# Altium project Austindetz_CM4_Board_v1.0.PrjPcb (part 1 of 2)
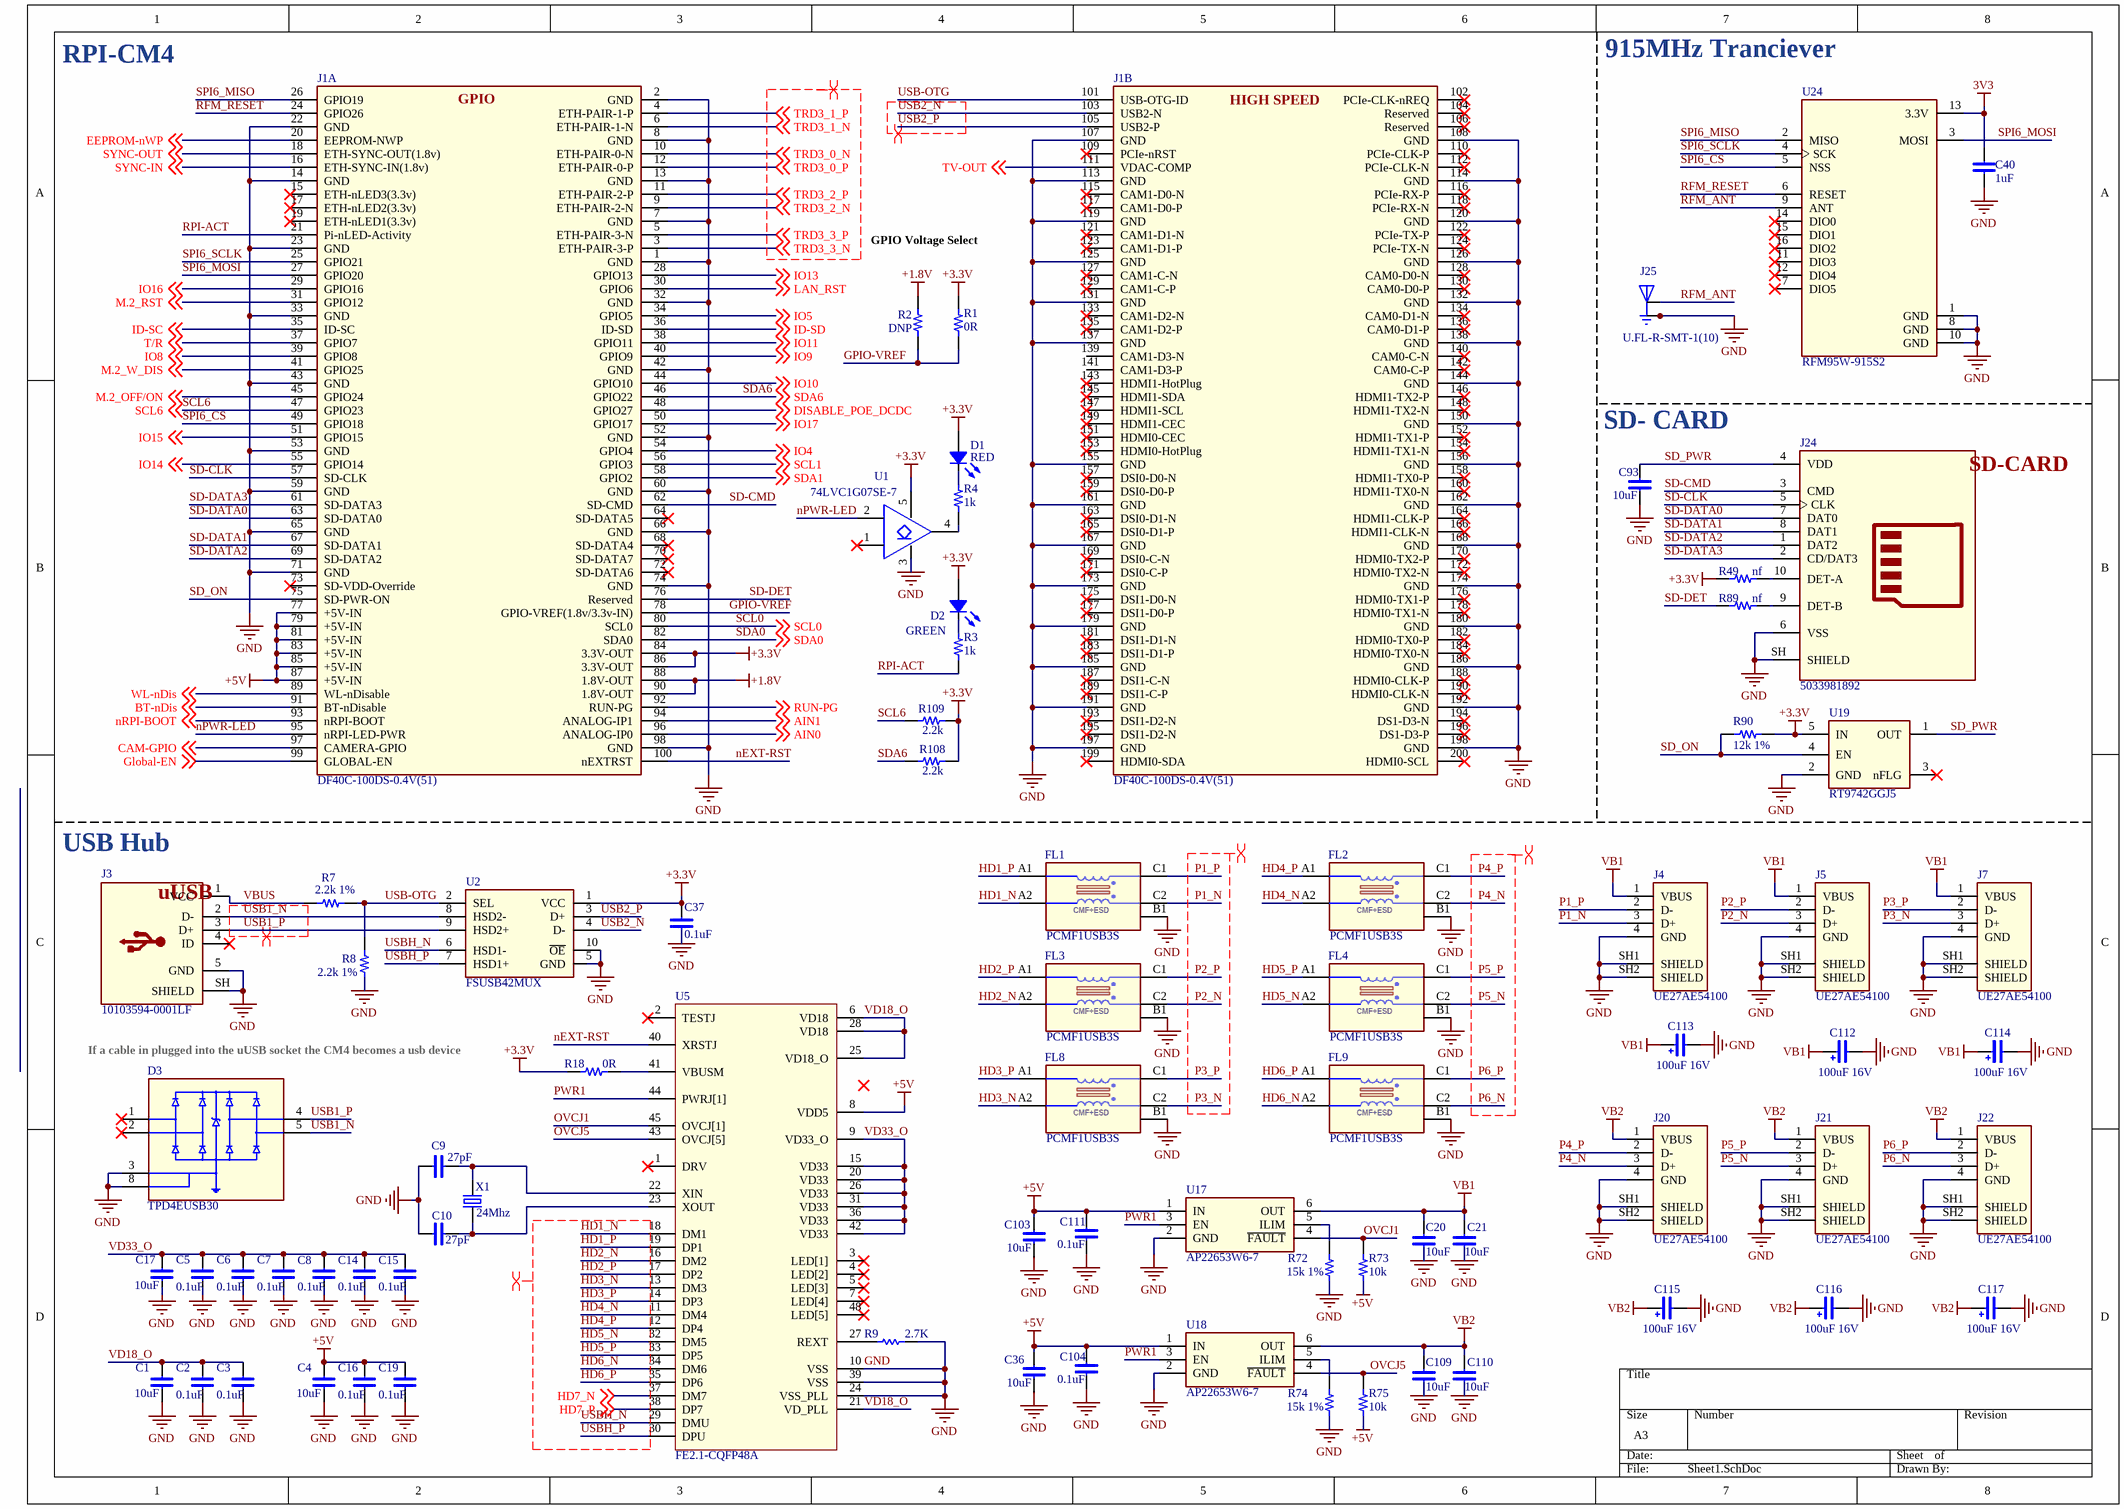
[diagram p0: Sheet1.SchDoc]
5 sheets, 407 parts. Net scope: global (net labels, ports and power ports of the same name join across sheets).
Board file: Austindetz_CM4_Board_v1.0.PcbDoc
Sheets:
  Sheet1.SchDoc
  Sheet2.SchDoc
  Sheet3.SchDoc
  Sheet4.SchDoc
  Sheet5.SchDoc

## Sheet Sheet1.SchDoc
size A3; DocumentNumber: 1; SheetNumber: 1; SheetTotal: 2

### Parts
C1  10uF  [C-0603/1608]
C2  0.1uF  [C-0402/1005]
C3  0.1uF  [C-0402/1005]
C4  10uF  [C-0603/1608]
C5  0.1uF  [C-0402/1005]
C6  0.1uF  [C-0402/1005]
C7  0.1uF  [C-0402/1005]
C8  0.1uF  [C-0402/1005]
C9  27pF  [C-0402/1005]
C10  27pF  [C-0402/1005]
C14  0.1uF  [C-0402/1005]
C15  0.1uF  [C-0402/1005]
C16  0.1uF  [C-0402/1005]
C17  10uF  [C-0603/1608]
C19  0.1uF  [C-0402/1005]
C20  10uF  [C-0603/1608]
C21  10uF  [C-0603/1608]
C36  10uF  [C-0603/1608]
C37  0.1uF  [C-0402/1005]
C40  1uF  [C-0402/1005]
C93  10uF  [C-0805/2012]
C103  10uF  [C-0603/1608]
C104  0.1uF  [C-0402/1005]
C109  10uF  [C-0603/1608]
C110  10uF  [C-0603/1608]
C111  0.1uF  [C-0402/1005]
C112  100uF 16V  [CAP-TAN-2312]
C113  100uF 16V  [CAP-TAN-2312]
C114  100uF 16V  [CAP-TAN-2312]
C115  100uF 16V  [CAP-TAN-2312]
C116  100uF 16V  [CAP-TAN-2312]
C117  100uF 16V  [CAP-TAN-2312]
D1  RED  [LED-0603-RED]
D2  GREEN  [LED-0603-Green]
D3  TPD4EUSB30  [10-USON (2.5x1)]
FL1  PCMF1USB3S  [WLCSP5(2-1-2)_NEX]
FL2  PCMF1USB3S  [WLCSP5(2-1-2)_NEX]
FL3  PCMF1USB3S  [WLCSP5(2-1-2)_NEX]
FL4  PCMF1USB3S  [WLCSP5(2-1-2)_NEX]
FL8  PCMF1USB3S  [WLCSP5(2-1-2)_NEX]
FL9  PCMF1USB3S  [WLCSP5(2-1-2)_NEX]
J1  DF40C-100DS-0.4V(51)  [RPI-CM4]  (parts A,B of 2)
J3  10103594-0001LF  [USB-micro]
J4  UE27AE54100  [AMPHENOL_UE27AE54100]
J5  UE27AE54100  [AMPHENOL_UE27AE54100]
J7  UE27AE54100  [AMPHENOL_UE27AE54100]
J20  UE27AE54100  [AMPHENOL_UE27AE54100]
J21  UE27AE54100  [AMPHENOL_UE27AE54100]
J22  UE27AE54100  [AMPHENOL_UE27AE54100]
J24  5033981892  [MOLEX-503398-1892]
J25  U.FL-R-SMT-1(10)  [HRS_U.FL-R-SMT-1(10)]
R1  0R  [R-0603/1608]
R2  DNP  [R-0603/1608]
R3  1k  [R-0402/1005]
R4  1k  [R-0402/1005]
R7  2.2k 1%  [R-0402/1005]
R8  2.2k 1%  [R-0402/1005]
R9  value 2.7K  [R-0402/1005]
R18  0R  [R-0402/1005]
R49  nf  [R-0402/1005]
R72  15k 1%  [R-0402/1005]
R73  10k  [R-0402/1005]
R74  15k 1%  [R-0402/1005]
R75  10k  [R-0402/1005]
R89  nf  [R-0402/1005]
R90  12k 1%  [R-0402/1005]
R108  2.2k  [R-0402/1005]
R109  2.2k  [R-0402/1005]
U1  74LVC1G07SE-7  [SOT-353]
U2  FSUSB42MUX  [10-MSOP-W3.0mm]
U5  FE2.1-CQFP48A  [PCBComponent_1]
U17  AP22653W6-7  [SOT-23-6]
U18  AP22653W6-7  [SOT-23-6]
U19  RT9742GGJ5  [SOT-23-5]
U24  RFM95W-915S2  [XCVR_RFM95W-915S2]
X1  24Mhz  [HC-49/US]

### Nets
3V3: C40.1 U24.13(3.3V)
+1.8V: J1.88(1.8V-OUT) J1.90(1.8V-OUT) R2.2
+3.3V: C37.1 D1.1 D2.1 J1.84(3.3V-OUT) J1.86(3.3V-OUT) R1.2 R18.1 R49.2 R90.1 R108.1 R109.1 U1.5 U2.1(VCC) U19.5(IN)
+5V: C4.1 C16.1 C19.1 C36.1 C103.1 C104.1 C111.1 J1.77(+5V-IN) J1.79(+5V-IN) J1.81(+5V-IN) J1.83(+5V-IN) J1.85(+5V-IN) J1.87(+5V-IN) R73.2 R75.2 U5.8(VDD5) U17.1(IN) U18.1(IN)
GND: C1.2 C2.2 C3.2 C4.2 C5.2 C6.2 C7.2 C8.2 C9.2 C10.2 C14.2 C15.2 C16.2 C17.2 C19.2 C20.2 C21.2 C36.2 C37.2 C40.2 C93.2 C103.2 C104.2 C109.2 C110.2 C111.2 C112.- C113.- C114.- C115.- C116.- C117.- D3.3(GND_3) D3.8(GND_8) FL1.B1(GND) FL2.B1(GND) FL3.B1(GND) FL4.B1(GND) FL8.B1(GND) FL9.B1(GND) J1.1(GND) J1.2(GND) J1.7(GND) J1.8(GND) J1.13(GND) J1.14(GND) J1.22(GND) J1.23(GND) J1.32(GND) J1.33(GND) J1.42(GND) J1.43(GND) J1.52(GND) J1.53(GND) J1.59(GND) J1.60(GND) J1.65(GND) J1.66(GND) J1.71(GND) J1.74(GND) J1.98(GND) J1.107(GND) J1.108(GND) J1.113(GND) J1.114(GND) J1.119(GND) J1.120(GND) J1.125(GND) J1.126(GND) J1.131(GND) J1.132(GND) J1.137(GND) J1.138(GND) J1.144(GND) J1.150(GND) J1.155(GND) J1.156(GND) J1.161(GND) J1.162(GND) J1.167(GND) J1.168(GND) J1.173(GND) J1.174(GND) J1.179(GND) J1.180(GND) J1.185(GND) J1.186(GND) J1.191(GND) J1.192(GND) J1.197(GND) J1.198(GND) J3.5(GND) J3.SH(SHIELD) J4.4(GND) J4.SH1(SHIELD) J4.SH2(SHIELD) J5.4(GND) J5.SH1(SHIELD) J5.SH2(SHIELD) J7.4(GND) J7.SH1(SHIELD) J7.SH2(SHIELD) J20.4(GND) J20.SH1(SHIELD) J20.SH2(SHIELD) J21.4(GND) J21.SH1(SHIELD) J21.SH2(SHIELD) J22.4(GND) J22.SH1(SHIELD) J22.SH2(SHIELD) J24.6(VSS) J24.SH(SHIELD) J25.1(GND) J25.3(GND) R8.2 R9.2 R72.1 R74.1 U1.3 U2.5(GND) U2.10(~{OE}) U5.10(VSS) U5.24(VSS_PLL) U5.39(VSS) U17.2(GND) U18.2(GND) U19.2(GND) U24.1(GND) U24.8(GND) U24.10(GND)
VB1: C20.1 C21.1 C112.+ C113.+ C114.+ J4.1(VBUS) J5.1(VBUS) J7.1(VBUS) U17.6(OUT)
VB2: C109.1 C110.1 C115.+ C116.+ C117.+ J20.1(VBUS) J21.1(VBUS) J22.1(VBUS) U18.6(OUT)
AIN0: J1.96(ANALOG-IP0) ; off-sheet AIN0
AIN1: J1.94(ANALOG-IP1) ; off-sheet AIN1
BT-nDis: J1.91(BT-nDisable) ; off-sheet BT-nDis
CAM-GPIO: J1.97(CAMERA-GPIO) ; off-sheet CAM-GPIO
DISABLE_POE_DCDC: J1.48(GPIO27) ; off-sheet DISABLE_POE_DCDC
EEPROM-nWP: J1.20(EEPROM-NWP) ; off-sheet EEPROM-nWP
Global-EN: J1.99(GLOBAL-EN) ; off-sheet Global-EN
GPIO-VREF: J1.78(GPIO-VREF(1.8v/3.3v-IN)) R1.1 R2.1
HD1_N: FL1.A2(CH1_IN-) U5.18(DM1)
HD1_P: FL1.A1(CH1_IN+) U5.19(DP1)
HD2_N: FL3.A2(CH1_IN-) U5.16(DM2)
HD2_P: FL3.A1(CH1_IN+) U5.17(DP2)
HD3_N: FL8.A2(CH1_IN-) U5.13(DM3)
HD3_P: FL8.A1(CH1_IN+) U5.14(DP3)
HD4_N: FL2.A2(CH1_IN-) U5.11(DM4)
HD4_P: FL2.A1(CH1_IN+) U5.12(DP4)
HD5_N: FL4.A2(CH1_IN-) U5.32(DM5)
HD5_P: FL4.A1(CH1_IN+) U5.33(DP5)
HD6_N: FL9.A2(CH1_IN-) U5.34(DM6)
HD6_P: FL9.A1(CH1_IN+) U5.35(DP6)
HD7_N: U5.37(DM7) ; off-sheet HD7_N
HD7_P: U5.38(DP7) ; off-sheet HD7_P
ID-SC: J1.35(ID-SC) ; off-sheet ID-SC
ID-SD: J1.36(ID-SD) ; off-sheet ID-SD
IO4: J1.54(GPIO4) ; off-sheet IO4
IO5: J1.34(GPIO5) ; off-sheet IO5
IO8: J1.39(GPIO8) ; off-sheet IO8
IO9: J1.40(GPIO9) ; off-sheet IO9
IO10: J1.44(GPIO10) ; off-sheet IO10
IO11: J1.38(GPIO11) ; off-sheet IO11
IO13: J1.28(GPIO13) ; off-sheet IO13
IO14: J1.55(GPIO14) ; off-sheet IO14
IO15: J1.51(GPIO15) ; off-sheet IO15
IO16: J1.29(GPIO16) ; off-sheet IO16
IO17: J1.50(GPIO17) ; off-sheet IO17
LAN_RST: J1.30(GPIO6) ; off-sheet LAN_RST
M.2_OFF/ON: J1.45(GPIO24) ; off-sheet M.2_OFF/ON
M.2_RST: J1.31(GPIO12) ; off-sheet M.2_RST
M.2_W_DIS: J1.41(GPIO25) ; off-sheet M.2_W_DIS
nEXT-RST: J1.100(nEXTRST) U5.40(XRSTJ)
nPWR-LED: J1.95(nRPI-LED-PWR) U1.2
nRPI-BOOT: J1.93(nRPI-BOOT) ; off-sheet nRPI-BOOT
OVCJ1: R73.1 U5.45(OVCJ[1]) U17.4(~{FAULT})
OVCJ5: R75.1 U5.43(OVCJ[5]) U18.4(~{FAULT})
P1_N: FL1.C2(CH1_OUT-) J4.3(D+)
P1_P: FL1.C1(CH1_OUT+) J4.2(D-)
P2_N: FL3.C2(CH1_OUT-) J5.3(D+)
P2_P: FL3.C1(CH1_OUT+) J5.2(D-)
P3_N: FL8.C2(CH1_OUT-) J7.3(D+)
P3_P: FL8.C1(CH1_OUT+) J7.2(D-)
P4_N: FL2.C2(CH1_OUT-) J20.3(D+)
P4_P: FL2.C1(CH1_OUT+) J20.2(D-)
P5_N: FL4.C2(CH1_OUT-) J21.3(D+)
P5_P: FL4.C1(CH1_OUT+) J21.2(D-)
P6_N: FL9.C2(CH1_OUT-) J22.3(D+)
P6_P: FL9.C1(CH1_OUT+) J22.2(D-)
PWR1: U5.44(PWRJ[1]) U17.3(EN) U18.3(EN)
RFM_ANT: J25.2(SIG) U24.9(ANT)
RFM_RESET: J1.24(GPIO26) U24.6(RESET)
RPI-ACT: J1.21(Pi-nLED-Activity) R3.2
RUN-PG: J1.92(RUN-PG) ; off-sheet RUN-PG
SCL0: J1.80(SCL0) ; off-sheet SCL0
SCL1: J1.56(GPIO3) ; off-sheet SCL1
SCL6: J1.47(GPIO23) R109.2 ; off-sheet SCL6
SD-CLK: J1.57(SD-CLK) J24.5(CLK)
SD-CMD: J1.62(SD-CMD) J24.3(CMD)
SD-DATA0: J1.63(SD-DATA0) J24.7(DAT0)
SD-DATA1: J1.67(SD-DATA1) J24.8(DAT1)
SD-DATA2: J1.69(SD-DATA2) J24.1(DAT2)
SD-DATA3: J1.61(SD-DATA3) J24.2(CD/DAT3)
SD-DET: J1.76(Reserved) R89.2
SD_ON: J1.75(SD-PWR-ON) R90.2 U19.4(EN)
SD_PWR: C93.1 J24.4(VDD) U19.1(OUT)
SDA0: J1.82(SDA0) ; off-sheet SDA0
SDA1: J1.58(GPIO2) ; off-sheet SDA1
SDA6: J1.46(GPIO22) R108.2 ; off-sheet SDA6
SPI6_CS: J1.49(GPIO18) U24.5(NSS)
SPI6_MISO: J1.26(GPIO19) U24.2(MISO)
SPI6_MOSI: J1.27(GPIO20) U24.3(MOSI)
SPI6_SCLK: J1.25(GPIO21) U24.4(SCK)
SYNC-IN: J1.16(ETH-SYNC-IN(1.8v)) ; off-sheet SYNC-IN
SYNC-OUT: J1.18(ETH-SYNC-OUT(1.8v)) ; off-sheet SYNC-OUT
T/R: J1.37(GPIO7) ; off-sheet T/R
TRD3_0_N: J1.10(ETH-PAIR-0-N) ; off-sheet TRD3_0_N
TRD3_0_P: J1.12(ETH-PAIR-0-P) ; off-sheet TRD3_0_P
TRD3_1_N: J1.6(ETH-PAIR-1-N) ; off-sheet TRD3_1_N
TRD3_1_P: J1.4(ETH-PAIR-1-P) ; off-sheet TRD3_1_P
TRD3_2_N: J1.9(ETH-PAIR-2-N) ; off-sheet TRD3_2_N
TRD3_2_P: J1.11(ETH-PAIR-2-P) ; off-sheet TRD3_2_P
TRD3_3_N: J1.3(ETH-PAIR-3-P) ; off-sheet TRD3_3_N
TRD3_3_P: J1.5(ETH-PAIR-3-N) ; off-sheet TRD3_3_P
TV-OUT: J1.111(VDAC-COMP) ; off-sheet TV-OUT
USB1_N: D3.5(D2-) J3.2(D-) U2.8(HSD2-)
USB1_P: D3.4(D2+) J3.3(D+) U2.9(HSD2+)
USB2_N: J1.103(USB2-N) U2.4(D-)
USB2_P: J1.105(USB2-P) U2.3(D+)
USB-OTG: J1.101(USB-OTG-ID) R7.1 R8.1 U2.2(SEL)
USBH_N: U2.6(HSD1-) U5.29(DMU)
USBH_P: U2.7(HSD1+) U5.30(DPU)
VBUS: J3.1(VCC) R7.2
VD18_O: C1.1 C2.1 C3.1 U5.6(VD18) U5.21(VD_PLL) U5.25(VD18_O) U5.28(VD18)
VD33_O: C5.1 C6.1 C7.1 C8.1 C14.1 C15.1 C17.1 U5.9(VD33_O) U5.15(VD33) U5.20(VD33) U5.26(VD33) U5.31(VD33) U5.36(VD33) U5.42(VD33)
WL-nDis: J1.89(WL-nDisable) ; off-sheet WL-nDis
NetC9_1: C9.1 U5.22(XIN) X1.2
NetC10_1: C10.1 U5.23(XOUT) X1.1
NetD1_2: D1.2 R4.1
NetD2_2: D2.2 R3.1
NetJ24_9: J24.9(DET-B) R89.1
NetJ24_10: J24.10(DET-A) R49.1
NetR4_2: R4.2 U1.4
NetR9_1: R9.1 U5.27(REXT)
NetR18_2: R18.2 U5.41(VBUSM)
NetR72_2: R72.2 U17.5(ILIM)
NetR74_2: R74.2 U18.5(ILIM)

Not connected (* = marked no-connect by the designer): D3 1(D1+)* 2(D1-)*; J1 15(ETH-nLED3(3.3v))* 17(ETH-nLED2(3.3v))* 19(ETH-nLED1(3.3v))* 64(SD-DATA5)* 68(SD-DATA4)* 70(SD-DATA7)* 72(SD-DATA6)* 73(SD-VDD-Override)* 102(PCIe-CLK-nREQ)* 104(Reserved)* 106(Reserved)* 109(PCIe-nRST)* 110(PCIe-CLK-P)* 112(PCIe-CLK-N)* 115(CAM1-D0-N)* 116(PCIe-RX-P)* 117(CAM1-D0-P)* 118(PCIe-RX-N)* 121(CAM1-D1-N)* 122(PCIe-TX-P)* 123(CAM1-D1-P)* 124(PCIe-TX-N)* 127(CAM1-C-N)* 128(CAM0-D0-N)* 129(CAM1-C-P)* 130(CAM0-D0-P)* 133(CAM1-D2-N)* 134(CAM0-D1-N)* 135(CAM1-D2-P)* 136(CAM0-D1-P)* 139(CAM1-D3-N) 140(CAM0-C-N)* 141(CAM1-D3-P) 142(CAM0-C-P)* 143(HDMI1-HotPlug)* 145(HDMI1-SDA)* 146(HDMI1-TX2-P)* 147(HDMI1-SCL)* 148(HDMI1-TX2-N)* 149(HDMI1-CEC)* 151(HDMI0-CEC)* 152(HDMI1-TX1-P)* 153(HDMI0-HotPlug)* 154(HDMI1-TX1-N)* 157(DSI0-D0-N)* 158(HDMI1-TX0-P)* 159(DSI0-D0-P)* 160(HDMI1-TX0-N)* 163(DSI0-D1-N)* 164(HDMI1-CLK-P)* 165(DSI0-D1-P)* 166(HDMI1-CLK-N)* 169(DSI0-C-N)* 170(HDMI0-TX2-P)* 171(DSI0-C-P)* 172(HDMI0-TX2-N)* 175(DSI1-D0-N)* 176(HDMI0-TX1-P)* 177(DSI1-D0-P)* 178(HDMI0-TX1-N)* 181(DSI1-D1-N)* 182(HDMI0-TX0-P)* 183(DSI1-D1-P)* 184(HDMI0-TX0-N)* 187(DSI1-C-N)* 188(HDMI0-CLK-P)* 189(DSI1-C-P)* 190(HDMI0-CLK-N)* 193(DSI1-D2-N)* 194(DS1-D3-N)* 195(DSI1-D2-N)* 196(DS1-D3-P)* 199(HDMI0-SDA)* 200(HDMI0-SCL)*; J3 4(ID)*; U1 1*; U5 1(DRV)* 2(TESTJ)* 3(LED[1])* 4(LED[2])* 5(LED[3])* 7(LED[4])* 48(LED[5])*; U19 3(nFLG)*; U24 7(DIO5)* 11(DIO3)* 12(DIO4)* 14(DIO0)* 15(DIO1)* 16(DIO2)*

### Layout directives
differential pair; differential pair class 90OHM: HD1_N, HD1_P, HD2_N, HD2_P, HD3_N, HD3_P, HD4_N, HD4_P, HD5_N, HD5_P, HD6_N, HD6_P, HD7_N, HD7_P, P1_N, P1_P, P2_N, P2_P, P3_N, P3_P, P4_N, P4_P, P5_N, P5_P, P6_N, P6_P, USB1_N, USB1_P, USB2_N, USB2_P, USBH_N, USBH_P
differential pair; differential pair class 100OHM: TRD3_0_N, TRD3_0_P, TRD3_1_N, TRD3_1_P, TRD3_2_N, TRD3_2_P, TRD3_3_N, TRD3_3_P

### Notes on the sheet
- RPI-CM4
- (near U24) 915MHz Tranciever
- GPIO Voltage Select
- (near C93) SD- CARD
- USB Hub
- If a cable in plugged into the uUSB socket the CM4 becomes a usb device
- (in symbol Nexperia, PCMF1USB3SZ) CMF+ESD
- (in symbol RPICM4, part A) GPIO
- (in symbol RPICM4, part B) HIGH SPEED
- (in symbol USB-Micro) uUSB

### Library data of the parts
C1 C4 C17 C20 C21 C36 C93 C103 C109 C110 = Capacitor-NonPolar: CAP CER 10UF 10V X7R 0805; Mfr. Part No.: GRM21BR71A106KA73K; Unit Price (USD): 0.19; Value: 10uF 10V; Supplier Part No.: 490-14381-1-ND; Supplier: Digikey Electronics
C2 C3 C5-C8 C14-C16 C19 C37 C104 C111 = Capacitor-NonPolar: CAP CER 0.1UF 16V X7R 0402; Mfr. Part No.: GCM155R71C104KA55D; Unit Price (USD): 0.1; Value: 0.1uF 16V; Supplier Part No.: 490-4759-1-ND; Supplier: Digikey Electronics
C9 C10 = Capacitor-NonPolar: CAP CER 27PF 50V CH 0402; Mfr. Part No.: UMK105CH270JVHF; Unit Price (USD): 0.1; Value: 27pF 50V; Supplier Part No.: 587-5076-1-ND; Supplier: Digikey Electronics
C40 = Capacitor-NonPolar: CAP CER 0.1UF 50V X7R 0402; Mfr. Part No.: UMK105B7104KV-FR; Value: 100nF; Unit Price (USD): 0.15; Supplier Part No.: 587-3498-1-ND; Supplier: Digikey Electronics
C112-C117 = Capacitor-Polar: CAP TANT 10UF 10% 16V 1206; Mfr. Part No.: F931C106KAAAJ6; Unit Price (USD): 0.67; Value: 10uF 16V; Supplier Part No.: 478-10723-1-ND; Supplier: Digikey Electronics
D1 = LED SMD: LED RED CLEAR CHIP SMD R/A; Mfr. Part No.: LTST-S270KRKT; Unit Price (USD): 0.24; Supplier Part No.: 160-1479-1-ND; Supplier: Digikey Electronics
D2 = LED SMD: LED GREEN CLEAR CHIP SMD R/A; Mfr. Part No.: LTST-S270KGKT; Unit Price (USD): 0.24; Supplier Part No.: 160-1478-1-ND; Supplier: Digikey Electronics
D3 = TPD4EUSB30: TVS DIODE 5.5V 8V 10USON; Mfr. Part No.: TPD4EUSB30DQAR; Unit Price (USD): 0.79; Supplier Part No.: 296-28063-1-ND; Supplier: Digikey Electronics
FL1-FL4 FL8 FL9 = Nexperia, PCMF1USB3SZ: FLT, SMT, WLCSP5, Common Mode EMI Filters; Supply Voltage: NO; Notes: NC; Value: PCMF1USB3S; Manufacturer: Nexperia; Mounting: SMT; Operating Temperature: -40ºC ~ +125ºC; Subpart Type: Common Mode EMI Filters; Footprint: WLCSP5; Manufacturer Part Number: PCMF1USB3S; Datasheet Link: https://www.nexperia.com/products/esd-protection-tvs-filtering-and-signal-conditioning/emi-solutions-with-integrated-protection/common-mode-filters-with-integrated-protection/PCMF1USB3S.html; Supply Current: NO; Substitutes Allowed: NO; Height: 0.6mm
J1 = RPICM4: CONN RCPT 100POS SMD GOLD; Unit Price (USD): 1.73; Supplier: Digikey Electronics; Supplier Part No.: H11615CT-ND; Mfr. Part No.: DF40C-100DS-0.4V(51)
J3 = USB-Micro: CONN RCPT USB2.0 MICRO B SMD R/A; Unit Price (USD): 0.72; Mfr. Part No.: 10103594-0001LF; Supplier Part No.: 609-4050-1-ND; Supplier: Digikey Electronics
J4 J5 J7 J20-J22 = UE27AE54100: MF: {'manufacturer': u'Amphenol ICC (Commercial Products)'}; Package: None; Price: None; Value: *; MP: UE27AE54100; Availability: Unavailable
J24 = SD-CARD: MICRO SD PUSH/PUSH SMALL 8C; Unit Price (USD): 2.41; Mfr. Part No.: 5033981892; Supplier Part No.: WM11190CT-ND; Supplier: Digikey Electronics
J25 = U.FL-R-SMT-1(10): U.FL Series 6 Ghz 50 Ohm Ultra-small SMT Coaxial Cable Receptacle; Availability: Unavailable; MP: U.FL-R-SMT-1(10); Value: *; Price: None; Package: None
R1 = Resistor: RESA-AS 0805 0R JUMPER 125MW; Mfr. Part No.: CR0805AJ/-000EAS; Unit Price (USD): 0.1; Value: 0R; Supplier Part No.: CR0805AJ/-000EASCT-ND; Supplier: Digikey Electronics
R2 = Resistor: CRGCQ 0402 470R 1%; Value: nf; Unit Price (USD): 0; Mfr. Part No.: nf; Supplier Part No.: nf; Supplier: nf
R3 R4 R49 R73 R75 R89 R108 R109 = Resistor: RES SMD 1K OHM 1% 1/16W 0402; Mfr. Part No.: RC0402FR-071KL; Unit Price (USD): 0.1; Value: 1k; Supplier Part No.: 311-1.00KLRCT-ND; Supplier: Digikey Electronics
R7 R8 = Resistor: RES SMD 2.2K OHM 1% 1/16W 0402; Mfr. Part No.: RT0402FRE072K2L; Unit Price (USD): 0.1; Value: 2.2k 1%; Supplier Part No.: 13-RT0402FRE072K2LCT-ND; Supplier: Digikey Electronics
R9 = Res1: Resistor; Published: 8-Jun-2000; LatestRevisionDate: 17-Jul-2002; LatestRevisionNote: Re-released for DXP Platform.; PackageReference: AXIAL-0.3; Publisher: Altium Limited; PackageDescription: Axial Device, Thru-Hole; 2 Leads; 0.3 in Pin Spacing
R18 = Resistor: RES SMD 2.2K OHM 1% 1/16W 0402; Mfr. Part No.: RT0402FRE072K2L; Value: 2.2k 1%; Unit Price (USD): 0.1; Supplier Part No.: 13-RT0402FRE072K2LCT-ND; Supplier: Digikey Electronics
R72 R74 = Resistor: RES SMD 15K OHM 1% 1/16W 0402; Mfr. Part No.: MCR01MZPF1502; Unit Price (USD): 0.1; Value: 15k 1%; Supplier Part No.: RHM15.0KLTR-ND; Supplier: Digikey Electronics
R90 = Resistor: RES SMD 12K OHM 1% 1/16W 0402; Mfr. Part No.: MCR01MZPF1202; Unit Price (USD): 0.12; Value: 12k 1%; Supplier Part No.: RHM12.0KLCT-ND; Supplier: Digikey Electronics
U1 = 74LVC1G07SE-7: IC BUF NON-INVERT 5.5V SOT353; Unit Price (USD): 0.26; Mfr. Part No.: 74LVC1G07SE-7; Supplier Part No.: 74LVC1G07SE-7DICT-ND; Supplier: Digikey Electronics
U2 = FSUSB42MUX: IC USB SWITCH DPDT 10MSOP; Unit Price (USD): 0.6; Mfr. Part No.: FSUSB42MUX; Supplier Part No.: FSUSB42MUXCT-ND; Supplier: Digikey Electronics
U5 = Component_1
U17 U18 = AP22653W6-7: LOAD SWITCH,SOT26,T&R,3K; Unit Price (USD): 0.42; Supplier Part No.: 31-AP22653W6-7CT-ND; Mfr. Part No.: AP22653W6-7; Supplier: Digikey Electronics
U19 = RT9742GGJ5: IC PWR SWTCH N-CHAN 1:1 TSOT23-5; Unit Price (USD): 1.52; Supplier Part No.: 1028-1436-1-ND; Mfr. Part No.: RT9742GGJ5; Supplier: Digikey Electronics
U24 = RFM95W-915S2: RFM95(W) - Low Power Long Range Transceiver Module V1.0; Availability: Unavailable; MP: RFM95W-915S2; Value: *; Package: None; Price: None
X1 = ST3215SB32768C0HPWBB: CRYSTAL 24.0000MHZ 18PF TH; Mfr. Part No.: ECS-240-18-4XEN; Unit Price (USD): 0.66; Supplier: Digikey Electronics; Supplier Part No.: XC1725-ND

## Sheet Sheet2.SchDoc
size A3; DocumentNumber: 2; SheetNumber: 2; SheetTotal: 2
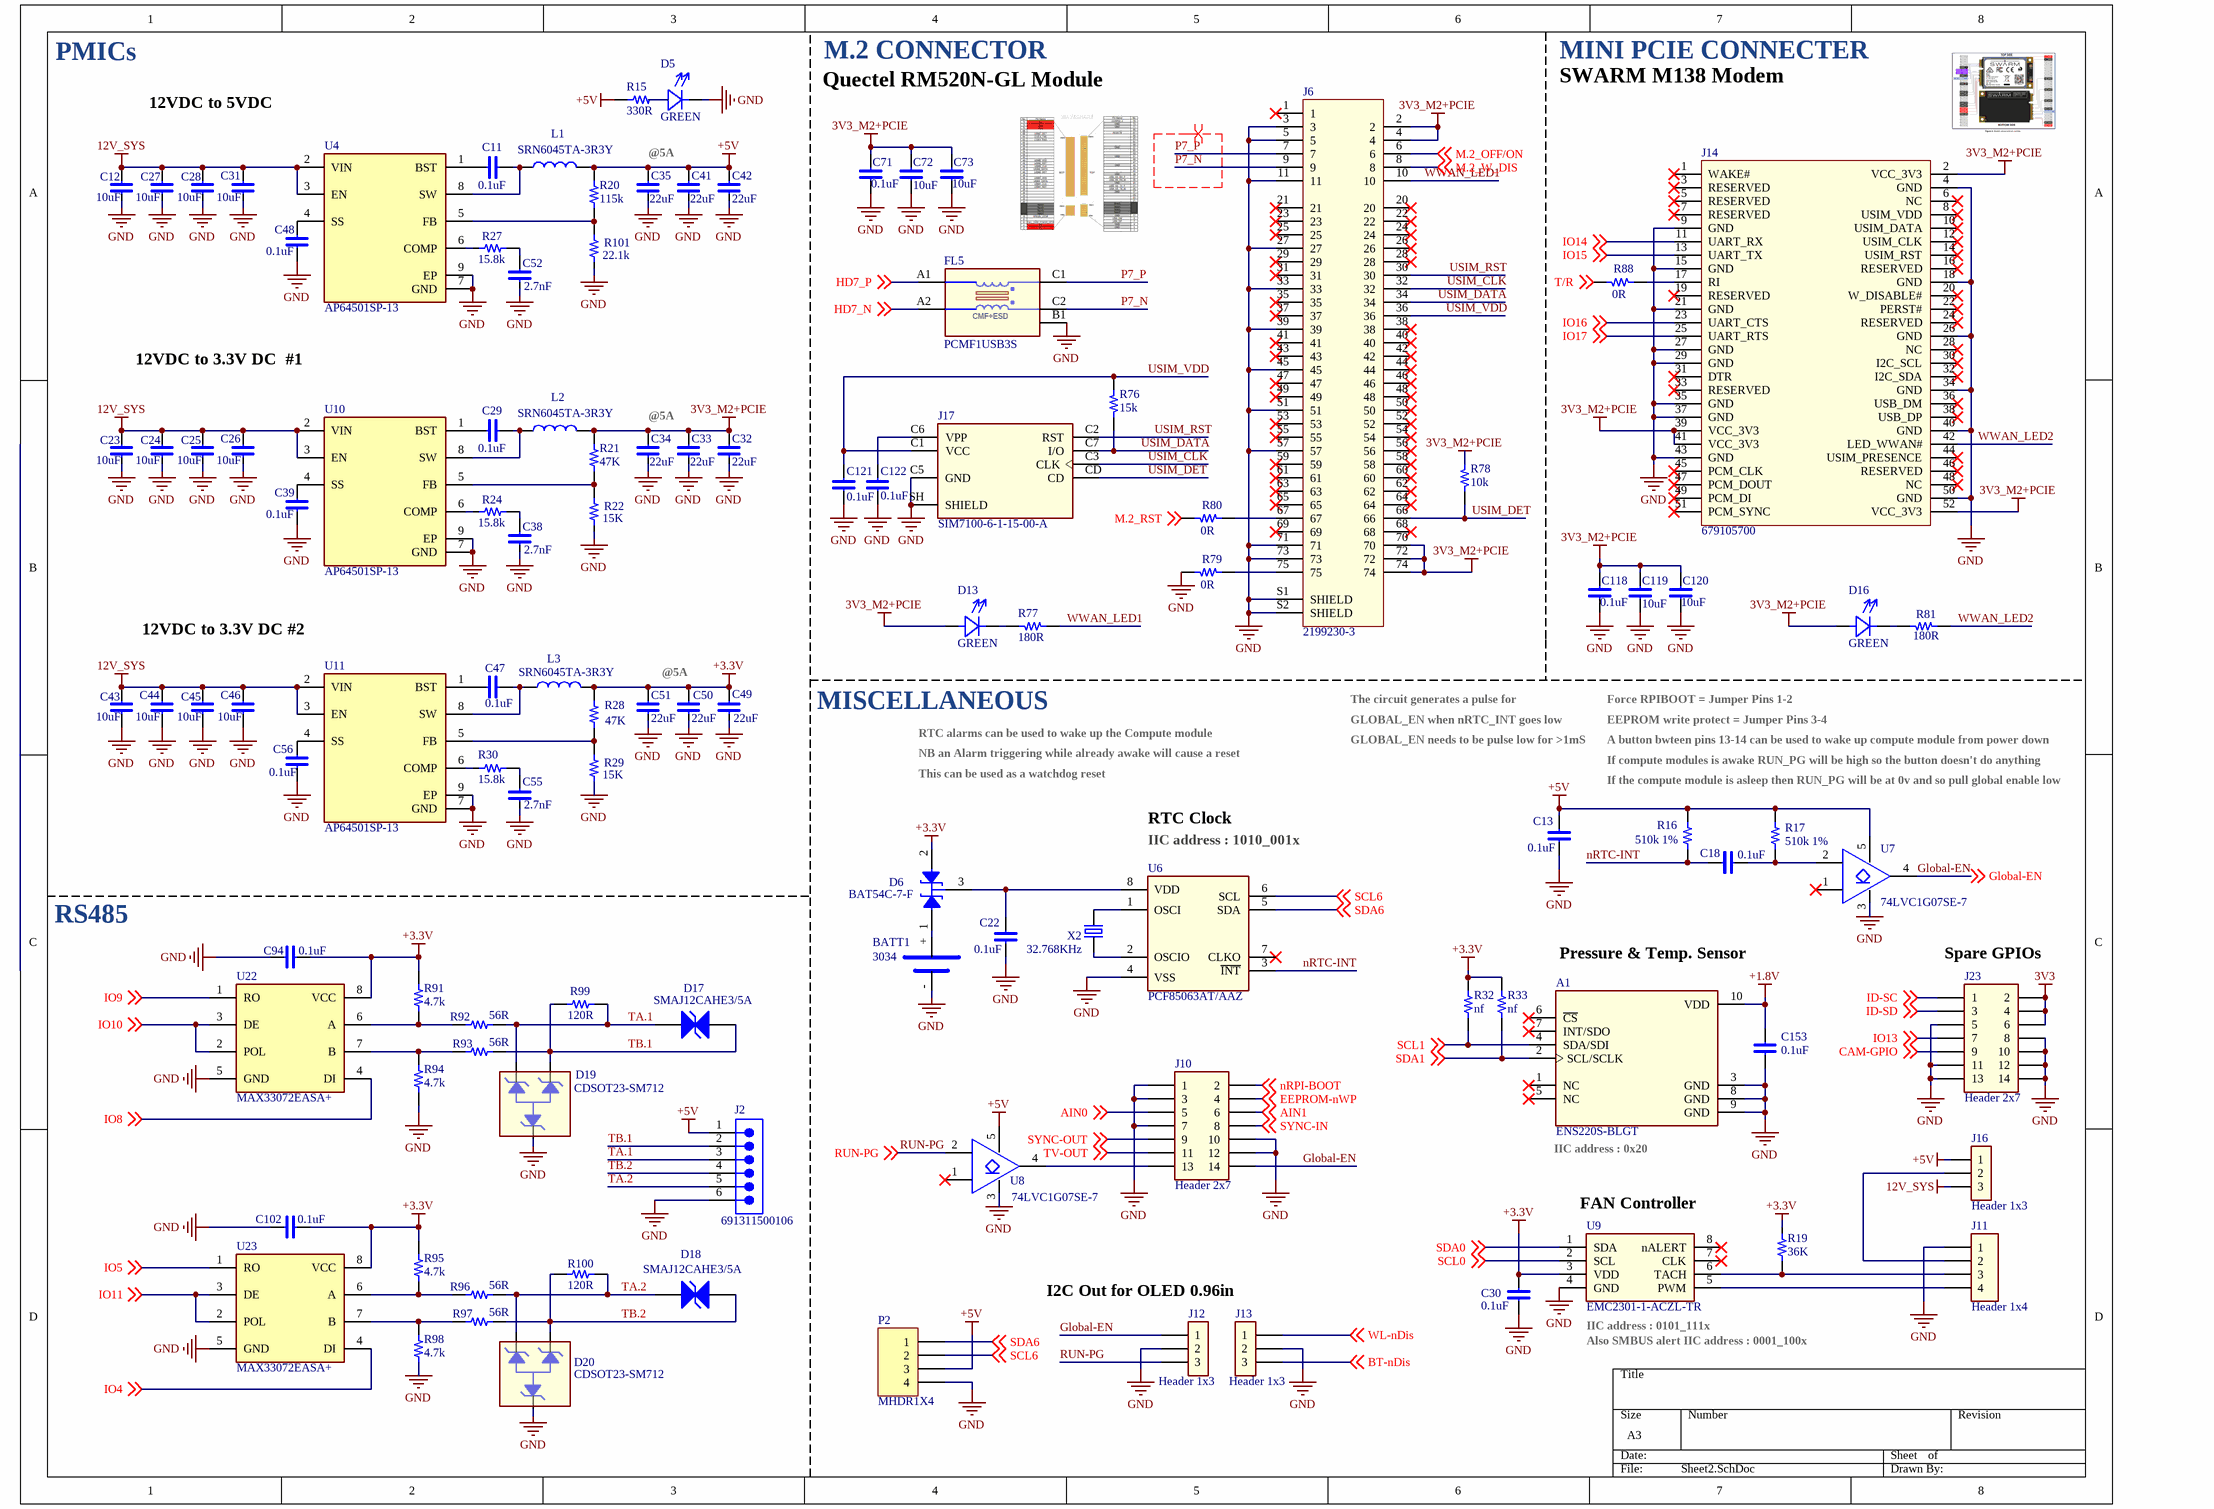
[diagram p1: Sheet2.SchDoc]

### Parts
A1  ENS220S-BLGT  [XDCR_ENS220S-BLGT]
BATT1  3034  [Keystone-3034]
C11  0.1uF  [C-0402/1005]
C12  10uF  [C-0805/2012]
C13  0.1uF  [C-0402/1005]
C18  0.1uF  [C-0402/1005]
C22  0.1uF  [C-0402/1005]
C23  10uF  [C-0805/2012]
C24  10uF  [C-0805/2012]
C25  10uF  [C-0805/2012]
C26  10uF  [C-0805/2012]
C27  10uF  [C-0805/2012]
C28  10uF  [C-0805/2012]
C29  0.1uF  [C-0402/1005]
C30  0.1uF  [C-0402/1005]
C31  10uF  [C-0805/2012]
C32  22uF  [C-0805/2012]
C33  22uF  [C-0805/2012]
C34  22uF  [C-0805/2012]
C35  22uF  [C-0805/2012]
C38  2.7nF  [C-0402/1005]
C39  0.1uF  [C-0402/1005]
C41  22uF  [C-0805/2012]
C42  22uF  [C-0805/2012]
C43  10uF  [C-0805/2012]
C44  10uF  [C-0805/2012]
C45  10uF  [C-0805/2012]
C46  10uF  [C-0805/2012]
C47  0.1uF  [C-0402/1005]
C48  0.1uF  [C-0402/1005]
C49  22uF  [C-0805/2012]
C50  22uF  [C-0805/2012]
C51  22uF  [C-0805/2012]
C52  2.7nF  [C-0402/1005]
C55  2.7nF  [C-0402/1005]
C56  0.1uF  [C-0402/1005]
C71  0.1uF  [C-0402/1005]
C72  10uF  [C-0603/1608]
C73  10uF  [C-0603/1608]
C94  0.1uF  [C-0402/1005]
C102  0.1uF  [C-0402/1005]
C118  0.1uF  [C-0402/1005]
C119  10uF  [C-0603/1608]
C120  10uF  [C-0603/1608]
C121  0.1uF  [C-0402/1005]
C122  0.1uF  [C-0402/1005]
C153  0.1uF  [C-0402/1005]
D5  GREEN  [LED-0603-Green]
D6  BAT54C-7-F  [SOT-23-3]
D13  GREEN  [LED-0402-GREEN]
D16  GREEN  [LED-0402-GREEN]
D17  SMAJ12CAHE3/5A  [VISH-DO-214AC-2_L]
D18  SMAJ12CAHE3/5A  [VISH-DO-214AC-2_L]
D19  CDSOT23-SM712  [SOT-23-3]
D20  CDSOT23-SM712  [SOT-23-3]
FL5  PCMF1USB3S  [WLCSP5(2-1-2)_NEX]
J2  691311500106  [691311500106]
J6  2199230-3  [TE_2199230-3]
J10  Header 2x7  [PIN HEADER 2x7 2.54mm]
J11  Header 1x4  [PIN HEADER 1x4 2.54mm]
J12  Header 1x3  [PIN HEADER 1x3 2.54mm]
J13  Header 1x3  [PIN HEADER 1x3 2.54mm]
J14  679105700  [679105700-A]
J16  Header 1x3  [PIN HEADER 1x3 2.54mm]
J17  SIM7100-6-1-15-00-A  [GCT_SIM7100-6-1-15-00-A_REVC]
J23  Header 2x7  [PIN HEADER 2x7 2.54mm]
L1  SRN6045TA-3R3Y  [IND_SRN6045TA-3R3Y]
L2  SRN6045TA-3R3Y  [IND_SRN6045TA-3R3Y]
L3  SRN6045TA-3R3Y  [IND_SRN6045TA-3R3Y]
P2  MHDR1X4  [PIN HEADER 1x4 2.54mm]
R15  330R  [R-0402/1005]
R16  510k 1%  [R-0402/1005]
R17  510k 1%  [R-0402/1005]
R19  36K  [R-0402/1005]
R20  115k  [R-0402/1005]
R21  47K  [R-0402/1005]
R22  15K  [R-0402/1005]
R24  15.8k  [R-0402/1005]
R27  15.8k  [R-0402/1005]
R28  47K  [R-0402/1005]
R29  15K  [R-0402/1005]
R30  15.8k  [R-0402/1005]
R32  nf  [R-0402/1005]
R33  nf  [R-0402/1005]
R76  15k  [R-0402/1005]
R77  180R  [R-0402/1005]
R78  10k  [R-0402/1005]
R79  0R  [R-0402/1005]
R80  0R  [R-0402/1005]
R81  180R  [R-0402/1005]
R88  0R  [R-0402/1005]
R91  4.7k  [R-0402/1005]
R92  56R  [R-0402/1005]
R93  56R  [R-0402/1005]
R94  4.7k  [R-0402/1005]
R95  4.7k  [R-0402/1005]
R96  56R  [R-0402/1005]
R97  56R  [R-0402/1005]
R98  4.7k  [R-0402/1005]
R99  120R  [R-0402/1005]
R100  120R  [R-0402/1005]
R101  22.1k  [R-0402/1005]
U4  AP64501SP-13  [FP-SO-8EP-IPC_A]
U6  PCF85063AT/AAZ  [SOIC-8 (W3.9mm)]
U7  74LVC1G07SE-7  [SOT-353]
U8  74LVC1G07SE-7  [SOT-353]
U9  EMC2301-1-ACZL-TR  [SOP65P490X110-8N]
U10  AP64501SP-13  [FP-SO-8EP-IPC_A]
U11  AP64501SP-13  [FP-SO-8EP-IPC_A]
U22  MAX33072EASA+  [FP-S8-4-IPC_B]
U23  MAX33072EASA+  [FP-S8-4-IPC_B]
X2  32.768KHz  [XTAL3215]

### Nets
3V3: J23.2 J23.4 J23.6
3V3_M2+PCIE: C32.1 C33.1 C34.1 C71.1 C72.1 C73.1 C118.1 C119.1 C120.1 D13.1(A) D16.1(A) J6.2 J6.4 J6.70 J6.72 J6.74 J14.2(VCC_3V3) J14.39(VCC_3V3) J14.41(VCC_3V3) J14.52(VCC_3V3) L2.1 R21.1 R78.2
12V_SYS: C12.1 C23.1 C24.1 C25.1 C26.1 C27.1 C28.1 C31.1 C43.1 C44.1 C45.1 C46.1 J16.3 U4.2(VIN) U4.3(EN) U10.2(VIN) U10.3(EN) U11.2(VIN) U11.3(EN)
+1.8V: A1.10(VDD) C153.1
+3.3V: C30.1 C49.1 C50.1 C51.1 C94.2 C102.2 D6.2 L3.1 R19.1 R28.1 R32.1 R33.1 R91.2 R95.2 U9.3(VDD) U22.8(VCC) U23.8(VCC)
+5V: C13.1 C35.1 C41.1 C42.1 J2.1 J16.1 L1.1 P2.3 R15.2 R16.2 R17.2 R20.1 U7.5 U8.5
GND: A1.3(GND) A1.8(GND) A1.9(GND) BATT1.-(_) C12.2 C13.2 C22.2 C23.2 C24.2 C25.2 C26.2 C27.2 C28.2 C30.2 C31.2 C32.2 C33.2 C34.2 C35.2 C38.2 C39.2 C41.2 C42.2 C43.2 C44.2 C45.2 C46.2 C48.2 C49.2 C50.2 C51.2 C52.2 C55.2 C56.2 C71.2 C72.2 C73.2 C94.1 C102.1 C118.2 C119.2 C120.2 C121.2 C122.2 C153.2 D5.2 D19.3 D20.3 FL5.B1(GND) J2.6 J6.3 J6.5 J6.11 J6.27 J6.33 J6.39 J6.45 J6.51 J6.57 J6.71 J6.73 J6.S1(SHIELD) J6.S2(SHIELD) J10.1 J10.3 J10.7 J10.10 J10.12 J11.1 J12.2 J13.2 J14.4(GND) J14.9(GND) J14.15(GND) J14.18(GND) J14.21(GND) J14.26(GND) J14.27(GND) J14.29(GND) J14.34(GND) J14.35(GND) J14.37(GND) J14.40(GND) J14.43(GND) J14.50(GND) J17.C5(GND) J17.SH(SHIELD) J23.5 J23.8 J23.10 J23.11 J23.12 J23.13 J23.14 P2.4 R22.2 R29.2 R79.2 R94.2 R98.2 R101.2 U4.7(GND) U4.9(EP) U6.4(VSS) U7.3 U8.3 U9.4(GND) U10.7(GND) U10.9(EP) U11.7(GND) U11.9(EP) U22.5(GND) U23.5(GND)
AIN0: J10.5 ; off-sheet AIN0
AIN1: J10.6 ; off-sheet AIN1
BT-nDis: J13.3 ; off-sheet BT-nDis
CAM-GPIO: J23.9 ; off-sheet CAM-GPIO
EEPROM-nWP: J10.4 ; off-sheet EEPROM-nWP
Global-EN: J10.14 J12.1 U7.4 ; off-sheet Global-EN
HD7_N: FL5.A2(CH1_IN-) ; off-sheet HD7_N
HD7_P: FL5.A1(CH1_IN+) ; off-sheet HD7_P
ID-SC: J23.1 ; off-sheet ID-SC
ID-SD: J23.3 ; off-sheet ID-SD
IO4: U23.4(DI) ; off-sheet IO4
IO5: U23.1(RO) ; off-sheet IO5
IO8: U22.4(DI) ; off-sheet IO8
IO9: U22.1(RO) ; off-sheet IO9
IO10: U22.2(POL) U22.3(DE) ; off-sheet IO10
IO11: U23.2(POL) U23.3(DE) ; off-sheet IO11
IO13: J23.7 ; off-sheet IO13
IO14: J14.11(UART_RX) ; off-sheet IO14
IO15: J14.13(UART_TX) ; off-sheet IO15
IO16: J14.23(UART_CTS) ; off-sheet IO16
IO17: J14.25(UART_RTS) ; off-sheet IO17
M.2_OFF/ON: J6.6 ; off-sheet M.2_OFF/ON
M.2_RST: R80.2 ; off-sheet M.2_RST
M.2_W_DIS: J6.8 ; off-sheet M.2_W_DIS
nRPI-BOOT: J10.2 ; off-sheet nRPI-BOOT
nRTC-INT: C18.1 R16.1 U6.3(~{INT})
P7_N: FL5.C2(CH1_OUT-) J6.9
P7_P: FL5.C1(CH1_OUT+) J6.7
RUN-PG: J12.3 U8.2 ; off-sheet RUN-PG
SCL0: U9.2(SCL) ; off-sheet SCL0
SCL1: A1.4(SDA/SDI) R32.2 ; off-sheet SCL1
SCL6: P2.2 U6.6(SCL) ; off-sheet SCL6
SDA0: U9.1(SDA) ; off-sheet SDA0
SDA1: A1.2(SCL/SCLK) R33.2 ; off-sheet SDA1
SDA6: P2.1 U6.5(SDA) ; off-sheet SDA6
SYNC-IN: J10.8 ; off-sheet SYNC-IN
SYNC-OUT: J10.9 ; off-sheet SYNC-OUT
T/R: R88.2 ; off-sheet T/R
TA.1: D17.1(A1) D19.1 J2.3 R92.2 R99.1
TA.2: D18.1(A1) D20.1 J2.5 R96.2 R100.1
TB.1: D17.2(A2) D19.2 J2.2 R93.2 R99.2
TB.2: D18.2(A2) D20.2 J2.4 R97.2 R100.2
TV-OUT: J10.11 ; off-sheet TV-OUT
USIM_CLK: J6.32 J17.C3(CLK)
USIM_DATA: J6.34 J17.C7(I/O) R76.1
USIM_DET: J6.66 J17.CD R78.1
USIM_RST: J6.30 J17.C2(RST)
USIM_VDD: C121.1 J6.36 J17.C1(VCC) R76.2
WL-nDis: J13.1 ; off-sheet WL-nDis
WWAN_LED1: J6.10 R77.1
WWAN_LED2: J14.42(LED_WWAN#) R81.1
NetBATT1_+: BATT1.+ D6.1
NetC11_1: C11.1 L1.2 U4.8(SW)
NetC11_2: C11.2 U4.1(BST)
NetC18_2: C18.2 R17.1 U7.2
NetC22_1: C22.1 D6.3 U6.8(VDD)
NetC29_1: C29.1 L2.2 U10.8(SW)
NetC29_2: C29.2 U10.1(BST)
NetC38_1: C38.1 R24.2
NetC39_1: C39.1 U10.4(SS)
NetC47_1: C47.1 L3.2 U11.8(SW)
NetC47_2: C47.2 U11.1(BST)
NetC48_1: C48.1 U4.4(SS)
NetC52_1: C52.1 R27.2
NetC55_1: C55.1 R30.2
NetC56_1: C56.1 U11.4(SS)
NetC122_1: C122.1 J17.C6(VPP)
NetD5_1: D5.1 R15.1
NetD13_2: D13.2(C) R77.2
NetD16_2: D16.2(C) R81.2
NetJ6_67: J6.67 R80.1
NetJ6_75: J6.75 R79.1
NetJ10_13: J10.13 U8.4
NetJ11_2: J11.2 J16.2
NetJ11_3: J11.3 R19.2 U9.6(TACH)
NetJ11_4: J11.4 U9.5(PWM)
NetJ14_17: J14.17(RI) R88.1
NetR20_2: R20.2 R101.1 U4.5(FB)
NetR21_2: R21.2 R22.1 U10.5(FB)
NetR24_1: R24.1 U10.6(COMP)
NetR27_1: R27.1 U4.6(COMP)
NetR28_2: R28.2 R29.1 U11.5(FB)
NetR30_1: R30.1 U11.6(COMP)
NetR91_1: R91.1 R92.1 U22.6(A)
NetR93_1: R93.1 R94.1 U22.7(B)
NetR95_1: R95.1 R96.1 U23.6(A)
NetR97_1: R97.1 R98.1 U23.7(B)
NetU6_1: U6.1(OSCI) X2.2
NetU6_2: U6.2(OSCIO) X2.1

Not connected (* = marked no-connect by the designer): A1 1(NC)* 5(NC)* 6(~{CS})* 7(INT/SDO)*; J6 1* 20* 21* 22* 23* 24* 25* 26* 28* 29* 31* 35* 37* 38* 40* 41* 42* 43* 44* 46* 47* 48* 49* 50* 52* 53* 54* 55* 56* 58* 59* 60* 61* 62* 63* 64* 65* 68* 69*; J14 1(WAKE#)* 3(RESERVED)* 5(RESERVED)* 6(NC)* 7(RESERVED)* 8(USIM_VDD)* 10(USIM_DATA)* 12(USIM_CLK)* 14(USIM_RST)* 16(RESERVED)* 19(RESERVED)* 20(W_DISABLE#)* 22(PERST#)* 24(RESERVED)* 28(NC)* 30(I2C_SCL)* 31(DTR)* 32(I2C_SDA)* 33(RESERVED)* 36(USB_DM)* 38(USB_DP)* 44(USIM_PRESENCE)* 45(PCM_CLK)* 46(RESERVED)* 47(PCM_DOUT)* 48(NC)* 49(PCM_DI)* 51(PCM_SYNC)*; U6 7(CLKO)*; U7 1*; U8 1*; U9 7(CLK)* 8(nALERT)*

### Layout directives
differential pair; differential pair class 90OHM: P7_N, P7_P

### Notes on the sheet
- PMICs
- 12VDC to 5VDC
- Quectel RM520N-GL Module
- M.2 CONNECTOR
- MINI PCIE CONNECTER
- SWARM M138 Modem
- @5A
- 12VDC to 3.3V DC  #1
- 12VDC to 3.3V DC #2
- MISCELLANEOUS
- The circuit generates a pulse for
- GLOBAL_EN when nRTC_INT goes low
- Force RPIBOOT = Jumper Pins 1-2
- EEPROM write protect = Jumper Pins 3-4
- RTC alarms can be used to wake up the Compute module
- NB an Alarm triggering while already awake will cause a reset
- This can be used as a watchdog reset
- GLOBAL_EN needs to be pulse low for >1mS
- A button bwteen pins 13-14 can be used to wake up compute module from power down
- If compute modules is awake RUN_PG will be high so the button doesn't do anything
- If the compute module is asleep then RUN_PG will be at 0v and so pull global enable low
- (near U6) IIC address : 1010_001x
- RTC Clock
- RS485
- Pressure & Temp. Sensor
- (near J23) Spare GPIOs
- (near A1) IIC address : 0x20
- (near U9) FAN Controller
- (near P2) I2C Out for OLED 0.96in
- (near U9) IIC address : 0101_111x
- Also SMBUS alert IIC address : 0001_100x
- (in symbol Nexperia, PCMF1USB3SZ) CMF+ESD

### Library data of the parts
A1 = ENS220S-BLGT: Board Mount Pressure Sensors ENS220S-BLGT LGA10 T&R 3K5 - Premium accuracy barometric pressureand temperature sensor for activitytracking and indoor navigation /localization; MF: ScioSense; SnapEDA_Link: https://www.snapeda.com/parts/ENS220S-BLGT/ScioSense/view-part/?ref=snap; Package: None; Value: *; MP: ENS220S-BLGT; Check_prices: https://www.snapeda.com/parts/ENS220S-BLGT/ScioSense/view-part/?ref=eda
BATT1 = Coin-Cell: BATTERY RETAINER COIN 20MM SMD; Unit Price (USD): 0.33; Mfr. Part No.: 3034; Supplier: Digikey Electronics; Supplier Part No.: 36-3034-ND
C11 C12 C23-C35 C38 C39 C41-C52 C55 C56 = CAP 1206/3216: CAP CER 10UF 25V X5R 1206; Mfr. Part No.: C1206C106M3PACTU; Unit Price (USD): 0.28; Supplier Part No.: 399-8153-1-ND; Supplier: Digikey Electronics
C13 C18 C22 C121 C122 C153 = Capacitor-NonPolar: as C2 on sheet Sheet1; Value: 0.1uF 16V; Supplier Part No.: 490-4759-1-ND; Supplier: Digikey Electronics
C71-C73 C94 C102 C118-C120 = Capacitor-NonPolar: as C40 on sheet Sheet1; Supplier Part No.: 587-3498-1-ND; Supplier: Digikey Electronics
D5 D13 D16 = Diode-LED: Supplier: Digikey Electronics
D6 = BAT54C-7-F: DIODE ARRAY SCHOTTKY 30V SOT23-3; Unit Price (USD): 0.18; Supplier Part No.: BAT54C-FDICT-ND; Mfr. Part No.: BAT54C-7-F; Supplier: Digikey Electronics
D17 D18 = CMP-0548-00111-2: Transient Voltage Suppressor, 6.40 to 231 V, 12 V Stand-off Voltage, Bi-Directional, -55 to 155 degC, 2-pin DO-214AC, Pb-Free, Tape and Reel; Manufacturer: Vishay Semiconductor; ID (uA): 2; IFSM: 40 A; VBR Bi-Directional (V): 6.4 to 231; VWM (V): 12; PPPM (W): 400, 300; ComponentLink1Description: Manufacturer URL; ComponentLink3Description: Package Specification; ComponentLink3URL: http://www.vishay.com/docs/88390/smaj50a.pdf; RoHS: TRUE; PackageDescription: 2-Pin DO-214AC (SMA), Body 4.245 x 2.665 mm; Packing: Tape and Reel; Operating Junction and Storage Temperature Range: -55 to 150 degC; ComponentLink2Description: Datasheet; PartNumber: SMAJ12CAHE3/5A; PackageReference: DO-214AC-2; ComponentLink2URL: http://www.vishay.com/docs/88390/smaj50a.pdf; DatasheetVersion: 12/8/2013; Mounting Technology: Surface Mount; ComponentLink1URL: http://www.vishay.com/
D19 D20 = RCLAMP3552T: TVS DIODE 3.5V 6.5V SLP1006N3T; Mfr. Part No.: RCLAMP3552T.TNT; Unit Price (USD): 0.48; Supplier Part No.: RCLAMP3552T.TNTCT-ND; Supplier: Digikey Electronics
FL5 = Nexperia, PCMF1USB3SZ: as FL1 on sheet Sheet1; Value: PCMF1USB3S; Manufacturer: Nexperia; Mounting: SMT; Operating Temperature: -40ºC ~ +125ºC; Subpart Type: Common Mode EMI Filters; Footprint: WLCSP5; Manufacturer Part Number: PCMF1USB3S; Datasheet Link: https://www.nexperia.com/products/esd-protection-tvs-filtering-and-signal-conditioning/emi-solutions-with-integrated-protection/common-mode-filters-with-integrated-protection/PCMF1USB3S.html; Supply Current: NO; Substitutes Allowed: NO; Height: 0.6mm
J2 = CMP-1502-02150-2: NexarPartId: 8917751; Gender: Male; Number of Contacts: 6; Number of Levels: 1; Pitch: 5.08mm; Current: 20A; Voltage: 300V; RoHS: Compliant; Height: 12mm; Termination: Solder; Packaging: Box; Orientation: Vertical; Lead Pitch: 5.08mm; Mount: Through Hole; Length: 8.5mm; Contact Plating: Tin; Number of Rows: 1; Width: 32.48mm; Contact Material: Brass; Number of Pins: 6; Color: Green; Number of Positions Per Level: 6; REACH SVHC: Unknown
J6 = 2199230-3: M.2 0.5PITCH 4.2H KEY B 15U'' AU; Package: None; MP: 2199230-3; Value: *; Availability: Unavailable; Price: None
J10 J23 = Header 2x7: CONN HEADER VERT 14POS 2.54MM; Mfr. Part No.: PRPC007DFBN-RC; Unit Price (USD): 0.47; Supplier Part No.: S2221EC-07-ND; Supplier: Digikey Electronics
J11 = Header 1x4: CONN HEADER VERT 4POS 2.54MM; Supplier: Digikey Electronics
J12 J13 J16 = Header 1x3: CONN HEADER VERT 3POS 2.54MM; Mfr. Part No.: 75160-156-03LF; Value: 51R; Unit Price (USD): 0.74; Supplier Part No.: 609-75160-156-03LF-ND; Supplier: Digikey Electronics
J14 U9 = Component_1
J17 = SIM7100-6-1-15-00-A_REVC: 7 _6 + 1_ Position Card Connector Micro SIM Surface Mount, Right Angle Gold; MF: Global Connector Technology; Package: None; Availability: Unavailable; SnapEDA_Link: https://www.snapeda.com/parts/SIM7100-6-1-15-00-A/Global%20Connector%20Technology/view-part/449163/?ref=snap; MP: SIM7100-6-1-15-00-A; Price: None; Value: *
L1-L3 = 4.3x4.3mm: FIXED IND 22UH 620MA 350 MOHM; Mfr. Part No.: ASPI-4020S-220M-T; Unit Price (USD): 0.48; Supplier Part No.: 535-12307-1-ND; Value: 22uH; Supplier: Digikey Electronics
P2 = MHDR1X4: Header, 4-Pin; LatestRevisionDate: 17-Jul-2002; LatestRevisionNote: Re-released for DXP Platform.; Publisher: Altium Limited
R15 R19-R22 R24 R27-R30 R76-R81 R88 R91-R101 = Resistor: RES SMD 51 OHM 0.5% 1/16W 0402; Mfr. Part No.: ERA-2AED510X; Value: 51R; Unit Price (USD): 0.21; Supplier Part No.: P51DECT-ND; Supplier: Digikey Electronics
R16 R17 = Resistor: RES SMD 510K OHM 1% 1/16W 0402; Mfr. Part No.: MCR01MZPF5103; Unit Price (USD): 0.1; Value: 510k 1%; Supplier Part No.: RHM510KLCT-ND; Supplier: Digikey Electronics
R32 R33 = Resistor: as R3 on sheet Sheet1; Value: 1k; Supplier Part No.: 311-1.00KLRCT-ND; Supplier: Digikey Electronics
U4 U10 U11 = CMP-12757-000024-1: DCDC CONV HV BUCK SO-8EP
U6 = PCF85063AT/AAZ: IC RTC CLK/CALENDAR I2C 8SOIC; Unit Price (USD): 0.335; Mfr. Part No.: PCF85063AT/AAZ; Supplier Part No.: 568-PCF85063AT/AAZCT-ND; Supplier: Digikey Electronics
U7 U8 = 74LVC1G07SE-7: as U1 on sheet Sheet1; Mfr. Part No.: 74LVC1G07SE-7; Supplier Part No.: 74LVC1G07SE-7DICT-ND; Supplier: Digikey Electronics
U22 U23 = CMP-05679-000063-1: DUAL VOLTAGE RS-485, 70V FP, 40V
X2 = ST3215SB32768C0HPWBB: CRYSTAL 32.7680KHZ 7PF SMD 20ppm; Mfr. Part No.: CM7V-T1A-32.768KHZ-7PF-20PPM-TB-QA; Unit Price (USD): 0.42; Supplier: Digikey Electronics; Supplier Part No.: 2195-CM7V-T1A-32.768KHZ-7PF-20PPM-TB-QACT-ND

## Sheet Sheet3.SchDoc
size A3; SPICEModelCacheKOLHZRAH: <root> / <DocumentId>KOLHZRAH</DocumentId> / </root>
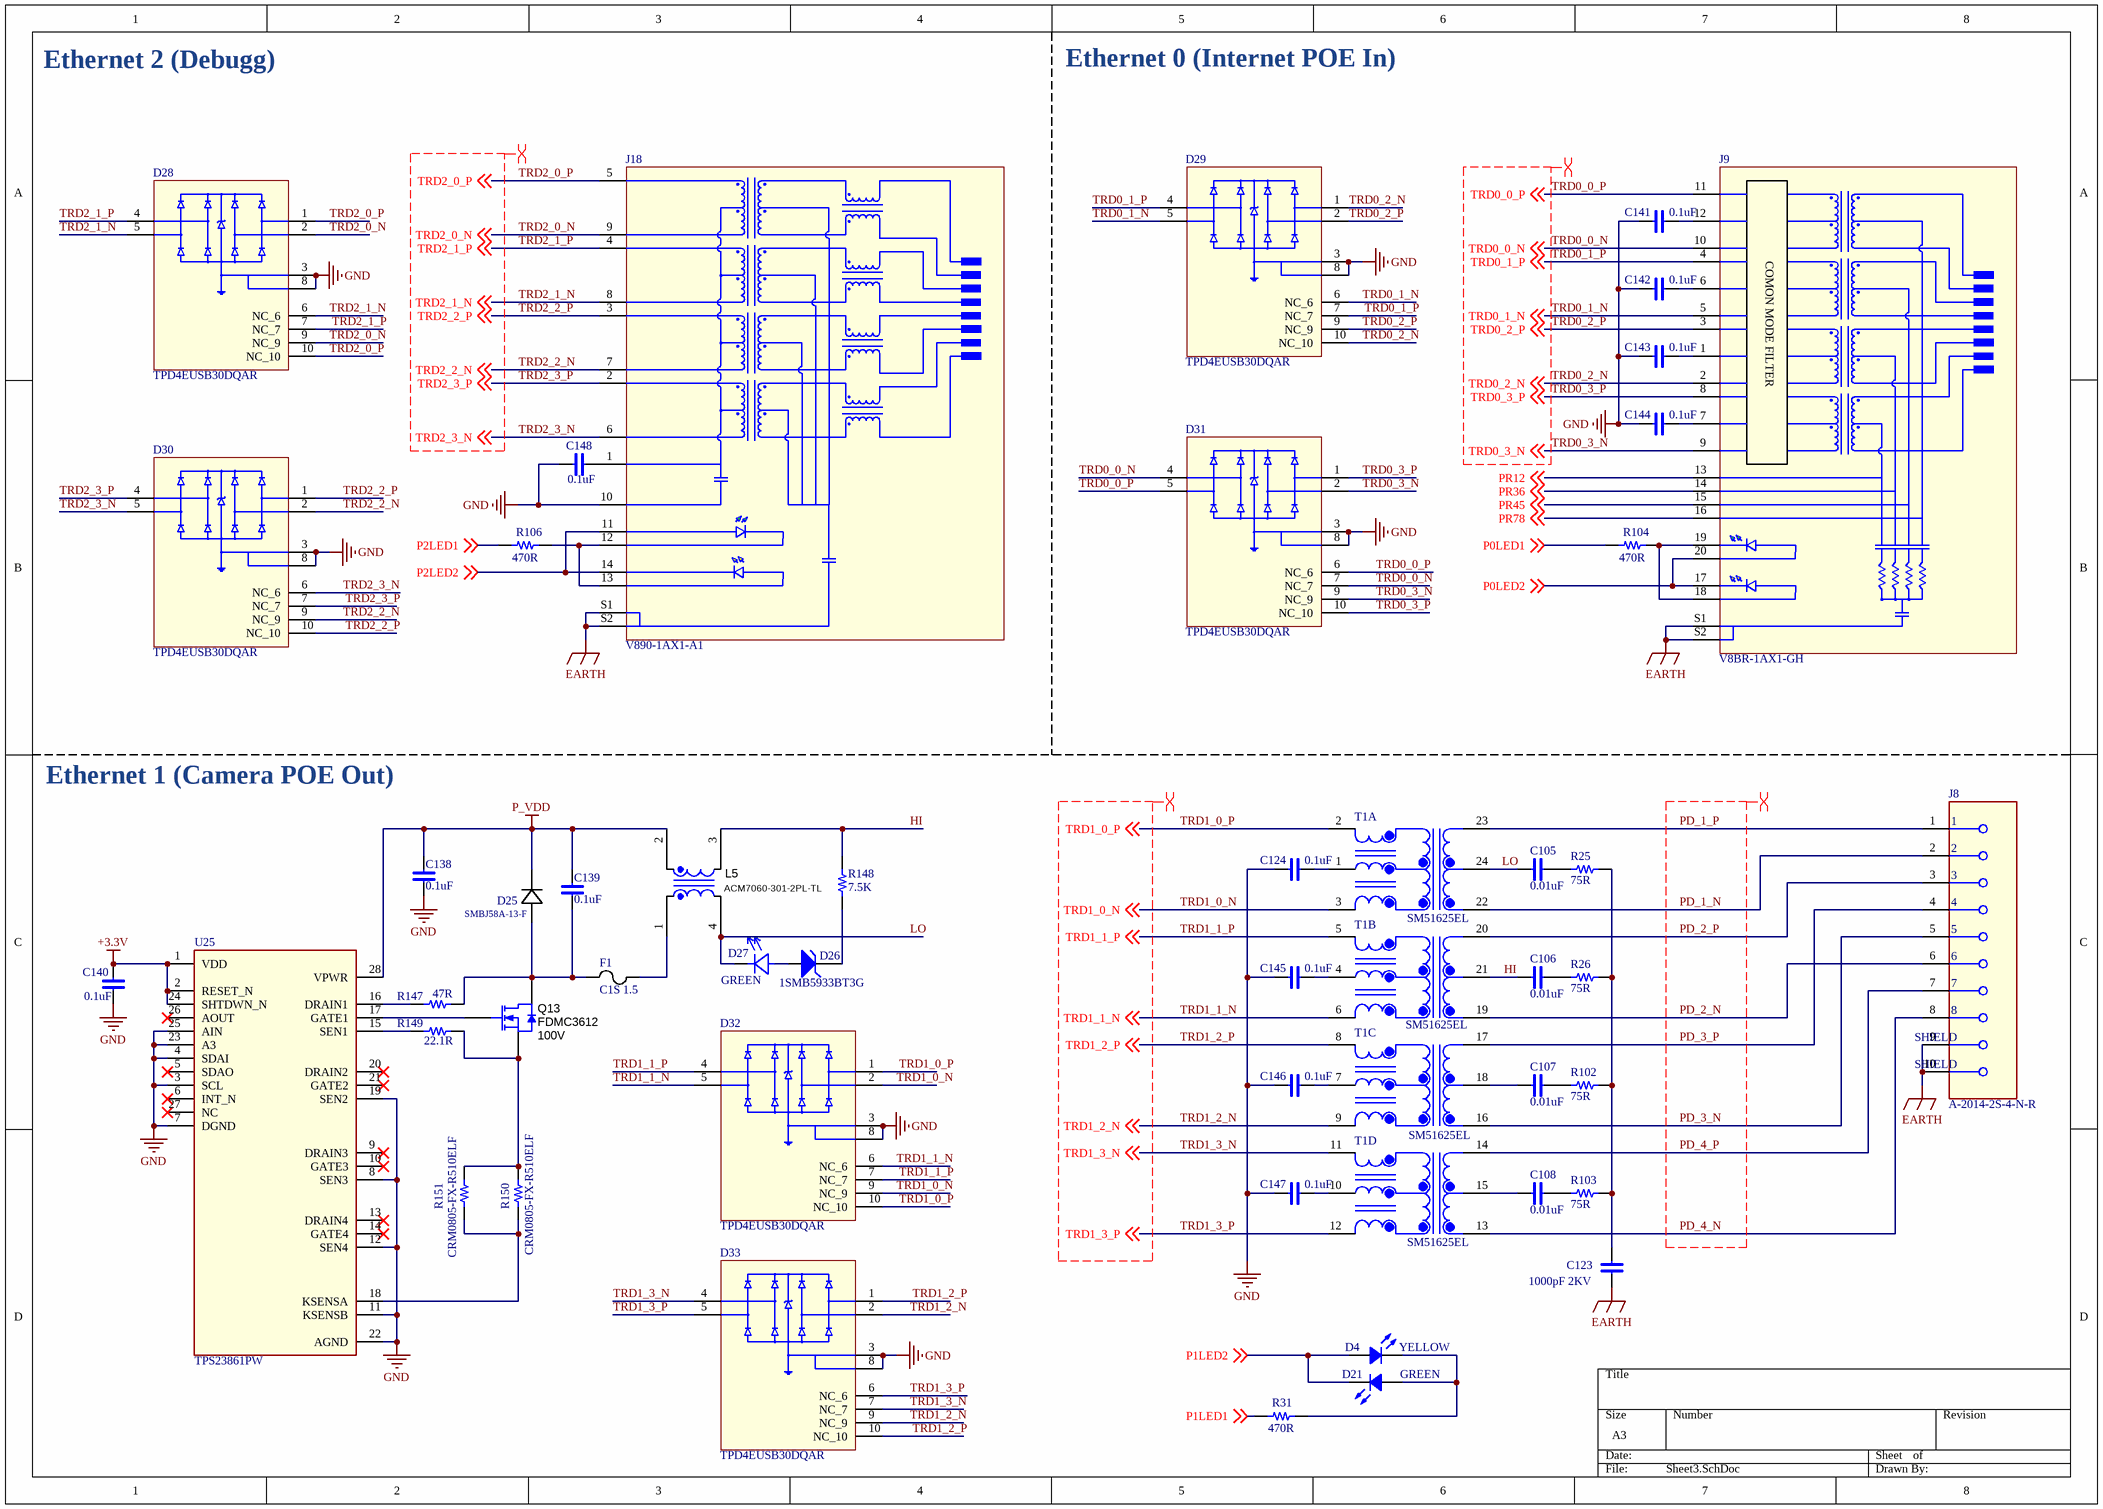
[diagram p2: Sheet3.SchDoc]

### Parts
C105  0.01uF  [C-0402/1005]
C106  0.01uF  [C-0402/1005]
C107  0.01uF  [C-0402/1005]
C108  0.01uF  [C-0402/1005]
C123  1000pF 2KV  [C-0402/1005]
C124  0.1uF  [C-0402/1005]
C138  0.1uF  [C-0402/1005]
C139  0.1uF  [C-0402/1005]
C140  0.1uF  [C-0402/1005]
C141  0.1uF  [C-0402/1005]
C142  0.1uF  [C-0402/1005]
C143  0.1uF  [C-0402/1005]
C144  0.1uF  [C-0402/1005]
C145  0.1uF  [C-0402/1005]
C146  0.1uF  [C-0402/1005]
C147  0.1uF  [C-0402/1005]
C148  0.1uF  [C-0402/1005]
D4  YELLOW  [LED-0603-RED]
D21  GREEN  [LED-0603-RED]
D25  SMBJ58A-13-F  [CR_SM12CA-13-F_DIO]
D26  1SMB5933BT3G  [ONSC-SMB-2-403A-03_H_V]
D27  GREEN  [LED-0603-Green]
D28  TPD4EUSB30DQAR  [IC_TPD4EUSB30DQAR]
D29  TPD4EUSB30DQAR  [IC_TPD4EUSB30DQAR]
D30  TPD4EUSB30DQAR  [IC_TPD4EUSB30DQAR]
D31  TPD4EUSB30DQAR  [IC_TPD4EUSB30DQAR]
D32  TPD4EUSB30DQAR  [IC_TPD4EUSB30DQAR]
D33  TPD4EUSB30DQAR  [IC_TPD4EUSB30DQAR]
F1  C1S 1.5  [C1_BEL]
J8  A-2014-2S-4-N-R  [ASSMANN_A-2014-2S-4-N-R]
J9  V8BR-1AX1-GH  [V8BR1AX1GH]
J18  V890-1AX1-A1  [BEL_V890-1AX1-A1]
L5  ACM7060-301-2PL-TL  [IND_ACM7060_TDK]
Q13  FDMC3612  value 100V  [MLP8_3P3X3P3_ONS]
R25  75R  [R-0402/1005]
R26  75R  [R-0402/1005]
R31  470R  [R-0402/1005]
R102  75R  [R-0402/1005]
R103  75R  [R-0402/1005]
R104  470R  [R-0402/1005]
R106  470R  [R-0402/1005]
R147  47R  [R-0402/1005]
R148  7.5K  [R-0805/2012]
R149  22.1R  [R-0402/1005]
R150  CRM0805-FX-R510ELF  [R-0805/2012]
R151  CRM0805-FX-R510ELF  [R-0805/2012]
T1  SM51625EL  [XFMR_SM51625EL]  (parts A,B,C,D of 4)
U25  TPS23861PW  [PW0028A_N]

### Nets
+3.3V: C140.1 U25.1(VDD) U25.2(RESET_N) U25.24(SHTDWN_N)
EARTH: C123.2 J8.9(MNT_1) J8.10(MNT_2) J9.S1(SHIELD) J9.S2(SHIELD) J18.S1(SHIELD) J18.S2(SHIELD)
GND: C124.1 C138.2 C140.2 C141.1 C142.1 C143.1 C144.1 C145.1 C146.1 C147.1 C148.1 D28.3(GND_3) D28.8(GND_8) D29.3(GND_3) D29.8(GND_8) D30.3(GND_3) D30.8(GND_8) D31.3(GND_3) D31.8(GND_8) D32.3(GND_3) D32.8(GND_8) D33.3(GND_3) D33.8(GND_8) J18.10(GND) U25.3(SCL) U25.4(SDAI) U25.7(DGND) U25.8(SEN3) U25.11(KSENSB) U25.12(SEN4) U25.19(SEN2) U25.22(AGND) U25.23(A3) U25.25(AIN)
P_VDD: C138.1 C139.1 D25.1 L5.2 U25.28(VPWR)
HI: C106.1 L5.3 R148.2 T1.21(MCT2)
LO: C105.1 D27.2 L5.4 T1.24(MCT1)
P0LED1: R104.1 ; off-sheet P0LED1
P0LED2: J9.17 J9.20 ; off-sheet P0LED2
P1LED1: R31.1 ; off-sheet P1LED1
P1LED2: D4.1 D21.2 ; off-sheet P1LED2
P2LED1: R106.1 ; off-sheet P2LED1
P2LED2: J18.11 J18.14 ; off-sheet P2LED2
PD_1_N: J8.2 T1.22(MX1-)
PD_1_P: J8.1 T1.23(MX1+)
PD_2_N: J8.6 T1.19(MX2-)
PD_2_P: J8.3 T1.20(MX2+)
PD_3_N: J8.5 T1.16(MX3-)
PD_3_P: J8.4 T1.17(MX3+)
PD_4_N: J8.8 T1.13(MX4-)
PD_4_P: J8.7 T1.14(MX4+)
PR12: J9.13(VC12) ; off-sheet PR12
PR36: J9.14(VC36) ; off-sheet PR36
PR45: J9.15(VC45) ; off-sheet PR45
PR78: J9.16(VC78) ; off-sheet PR78
TRD0_0_N: D31.4(D2+) D31.7(NC_7) J9.10(TRD1-) ; off-sheet TRD0_0_N
TRD0_0_P: D31.5(D2-) D31.6(NC_6) J9.11(TRD1+) ; off-sheet TRD0_0_P
TRD0_1_N: D29.5(D2-) D29.6(NC_6) J9.5(TRD2-) ; off-sheet TRD0_1_N
TRD0_1_P: D29.4(D2+) D29.7(NC_7) J9.4(TRD2+) ; off-sheet TRD0_1_P
TRD0_2_N: D29.1(D1+) D29.10(NC_10) J9.2(TRD3-) ; off-sheet TRD0_2_N
TRD0_2_P: D29.2(D1-) D29.9(NC_9) J9.3(TRD3+) ; off-sheet TRD0_2_P
TRD0_3_N: D31.2(D1-) D31.9(NC_9) J9.9(TRD4-) ; off-sheet TRD0_3_N
TRD0_3_P: D31.1(D1+) D31.10(NC_10) J9.8(TRD4+) ; off-sheet TRD0_3_P
TRD1_0_N: D32.2(D1-) D32.9(NC_9) T1.3(TD1-) ; off-sheet TRD1_0_N
TRD1_0_P: D32.1(D1+) D32.10(NC_10) T1.2(TD1+) ; off-sheet TRD1_0_P
TRD1_1_N: D32.5(D2-) D32.6(NC_6) T1.6(TD2-) ; off-sheet TRD1_1_N
TRD1_1_P: D32.4(D2+) D32.7(NC_7) T1.5(TD2+) ; off-sheet TRD1_1_P
TRD1_2_N: D33.2(D1-) D33.9(NC_9) T1.9(TD3-) ; off-sheet TRD1_2_N
TRD1_2_P: D33.1(D1+) D33.10(NC_10) T1.8(TD3+) ; off-sheet TRD1_2_P
TRD1_3_N: D33.4(D2+) D33.7(NC_7) T1.11(TD4+) ; off-sheet TRD1_3_N
TRD1_3_P: D33.5(D2-) D33.6(NC_6) T1.12(TD4-) ; off-sheet TRD1_3_P
TRD2_0_N: D28.2(D1-) D28.9(NC_9) J18.9(TRD1-) ; off-sheet TRD2_0_N
TRD2_0_P: D28.1(D1+) D28.10(NC_10) J18.5(TRD1+) ; off-sheet TRD2_0_P
TRD2_1_N: D28.5(D2-) D28.6(NC_6) J18.8(TRD2-) ; off-sheet TRD2_1_N
TRD2_1_P: D28.4(D2+) D28.7(NC_7) J18.4(TRD2+) ; off-sheet TRD2_1_P
TRD2_2_N: D30.2(D1-) D30.9(NC_9) J18.7(TRD3-) ; off-sheet TRD2_2_N
TRD2_2_P: D30.1(D1+) D30.10(NC_10) J18.3(TRD3+) ; off-sheet TRD2_2_P
TRD2_3_N: D30.5(D2-) D30.6(NC_6) J18.6(TRD4-) ; off-sheet TRD2_3_N
TRD2_3_P: D30.4(D2+) D30.7(NC_7) J18.2(TRD4+) ; off-sheet TRD2_3_P
NetC105_2: C105.2 R25.1
NetC106_2: C106.2 R26.1
NetC107_1: C107.1 T1.18(MCT3)
NetC107_2: C107.2 R102.1
NetC108_1: C108.1 T1.15(MCT4)
NetC108_2: C108.2 R103.1
NetC123_1: C123.1 R25.2 R26.2 R102.2 R103.2
NetC124_2: C124.2 T1.1(TCT1)
NetC139_2: C139.2 D25.2 F1.1 Q13.5(D) R147.2
NetC141_2: C141.2 J9.12(TRCT1)
NetC142_2: C142.2 J9.6(TRCT2)
NetC143_2: C143.2 J9.1(TRCT3)
NetC144_2: C144.2 J9.7(TRCT4)
NetC145_2: C145.2 T1.4(TCT2)
NetC146_2: C146.2 T1.7(TCT3)
NetC147_2: C147.2 T1.10(TCT4)
NetC148_2: C148.2 J18.1(TRDCT1/2/3/4)
NetD4_2: D4.2 D21.1 R31.2
NetD26_1: D26.1(K) R148.1
NetD26_2: D26.2(A) D27.1
NetF1_2: F1.2 L5.1
NetJ9_18: J9.18 J9.19 R104.2
NetJ18_12: J18.12 J18.13 R106.2
NetQ13_1: Q13.1(S) R149.2 R150.2 R151.2
NetQ13_4: Q13.4(G) U25.17(GATE1)
NetR147_1: R147.1 U25.16(DRAIN1)
NetR149_1: R149.1 U25.15(SEN1)
NetR150_1: R150.1 R151.1 U25.18(KSENSA)

Not connected (* = marked no-connect by the designer): U25 5(SDAO)* 6(INT_N)* 9(DRAIN3)* 10(GATE3)* 13(DRAIN4)* 14(GATE4)* 20(DRAIN2)* 21(GATE2)* 26(AOUT)* 27(NC)*

### Layout directives
differential pair; differential pair class 100OHM: PD_1_N, PD_1_P, PD_2_N, PD_2_P, PD_3_N, PD_3_P, PD_4_N, PD_4_P, TRD0_0_N, TRD0_0_P, TRD0_1_N, TRD0_1_P, TRD0_2_N, TRD0_2_P, TRD0_3_N, TRD0_3_P, TRD1_0_N, TRD1_0_P, TRD1_1_N, TRD1_1_P, TRD1_2_N, TRD1_2_P, TRD1_3_N, TRD1_3_P, TRD2_0_N, TRD2_0_P, TRD2_1_N, TRD2_1_P, TRD2_2_N, TRD2_2_P, TRD2_3_N, TRD2_3_P

### Notes on the sheet
- Ethernet 2 (Debugg)
- Ethernet 0 (Internet POE In)
- Ethernet 1 (Camera POE Out)
- (in symbol A-2014-2-4-N-T-R) SHIELD
- (in symbol V8BR-1AX1-GH) COMON MODE FILTER

### Library data of the parts
C105-C108 C123 C124 C138-C148 = Capacitor-NonPolar: as C40 on sheet Sheet1; Supplier Part No.: 587-3498-1-ND; Supplier: Digikey Electronics
D4 D21 = LED SMD: as D1 on sheet Sheet1; Supplier Part No.: 160-1479-1-ND; Supplier: Digikey Electronics
D25 = SMBJ58A-13-F: No Description Available; Mfr_Name: Diodes Inc; Type: DEV; Copyright: Copyright (C) 2023 Ultra Librarian. All rights reserved.; Manufacturer_Part_Number: SMBJ58A-13-F; RefDes: RefDes
D26 = CMP-1060-00149-1: 3 W Zener Voltage Regulator, 2-Pin SMB, Pb-Free, Tape and Reel; Manufacturer: On Semiconductor; VZ Typ (V): 22; RoHS: Pb-Free; ComponentLink1Description: Manufacturer URL; PackageDescription: 2-Pin Small Molded Package, J-Bend Lead, Body 4.33 x 3.625 mm; Packing: Tape and Reel; PartNumber: 1SMB5933BT3G; Mounting Technology: Surface Mount; ComponentLink3URL: http://www.onsemi.com/pub_link/Collateral/1SMB5913BT3-D.PDF; PackageReference: SMB-2-403A-03_H; ComponentLink2URL: http://www.onsemi.com/pub_link/Collateral/1SMB5913BT3-D.PDF; ComponentLink2Description: Datasheet; DatasheetVersion: Rev. 8; ComponentLink3Description: Package Specification; ComponentLink1URL: http://www.onsemi.com/; PackageVersion: Rev. H, 05/2011
D27 = Diode-LED: Supplier: Digikey Electronics
D28-D33 = TPD4EUSB30DQAR: 4-channel ESD solution for SuperSpeed (6 Gbps) USB 3.0 interface 10-USON -40 to 85; Value: *; Package: None; MP: TPD4EUSB30DQAR; Price: None; Availability: Unavailable
F1 = C1S 1.5: No Description Available; Mfr_Name: Belfuse; Type: DEV; Copyright: Copyright (C) 2023 Ultra Librarian. All rights reserved.; Manufacturer_Part_Number: C1S 1.5; RefDes: RefDes
J8 = A-2014-2-4-N-T-R: Jack Modular Connector 8p8c (RJ45, Ethernet) Vertical Unshielded; MF: ASSMANN WSW Components; MP: A-2014-2-4-N-T-R; Purchase-URL: https://pricing.snapeda.com/search/part/A-2014-2-4-N-T-R/?ref=eda; SnapEDA_Link: https://www.snapeda.com/parts/A-2014-2-4-N-T-R/ASSMANN%20WSW%20Components/view-part/899781/?ref=snap; Package: None; Value: *; Digi-Key_Part_Number: AE10396-ND
J9 = V8BR-1AX1-GH: Conn RJ-45 F 8 POS 1.02mm Solder ST Thru-Hole 20 Terminal 1 Port Tray; Manufacturer_Name: Bel Magnetic Solutions; Geometry.Height: 17.02mm; Manufacturer_Part_Number: V8BR-1AX1-GH; Mouser Part Number: 530-V8BR-1AX1-GH; Mouser Price/Stock: https://www.mouser.co.uk/ProductDetail/Bel-Magnetic-Solutions/V8BR-1AX1-GH?qs=DPoM0jnrROWshWkc%2FQR6HQ%3D%3D; Arrow Part Number: *; Arrow Price/Stock: *; Datasheet Link: https://belfuse.com/resources/drawings/magneticsolutions/dr-MAG-V8BR-1AX1-GH.pdf
J18 = V890-1AX1-A1: MagJack 1000BaseT | 1X1 | G/Y | Vertical | RoHS; MF: Bel Magnetic Solutions; Value: *; Mouser-Purchase-URL: https://snapeda.com/shop?store=Mouser&id=423023; Package: None; Digi-Key_Part_Number: V890-1AX1-A1A-ND; MP: V890-1AX1-A1; SnapEDA_Link: https://www.snapeda.com/parts/V890-1AX1-A1/Bel%20Magnetic%20Solutions/view-part/423023/?ref=snap
L5 = ACM7060-301-2PL-TL: Coupled inductor, 5A, 0.01 ohm, SMD; Manufacturer: TDK; SymbolCreator: a0799628; Config: Common Chokes; Value: uH; DCR_Ohm: 0.01; Isat: 5; U/M: EA; SymbolVersion: 2013-03-27; ComponentName: ACM7060-301-2PL-TL; PartNumber: ACM7060-301-2PL-TL; Supplier 1: Digi-Key; Supplier Part Number 1: 445-2214-1-ND; PackageReference: 6x3.5x7 mm; MountType: SMT; RoHS: Y; CompType: Coupled Inductor; Published: 2008-05-16; LatestRevisionDate: 2013-10-29; Publisher: Texas Instruments; ComponentLink1Description: Datasheet link; ComponentLink1URL: http://www.tdk.co.jp/tefe02/e9713_acm.pdf
Q13 = FDMC3612: MOSFET, N-CH, 100V, 3.3A, 3.3x1x3.3mm; Manufacturer: Fairchild Semiconductor; Alternate Manufacturer: None; U/M: EA; ChType: N; VdsMax_V: 100; Value1: 0.11 ohm; Rdson45_Ohm: 0.11; Value2: 21 nC; QgTyp_nC: 21; Vgs_V: 4; IdsMax_A: 3.3; SymbolVersion: 2008-07-09; CompType: MOSFET; PartNumber: FDMC3612; PackageReference: 3.3x1x3.3mm; RoHS: Y; MountType: SMT; Published: 2008-06-19; Publisher: Texas Instruments; LatestRevisionDate: 2013-08-15; LatestRevisionNote: Added parts.; ComponentLink1Description: Datasheet link; ComponentLink1URL: http://www.fairchildsemi.com/ds/FD/FDMC3612.pdf; Supplier 1: Digi-Key; Supplier Part Number 1: FDMC3612CT-ND; Supplier 2: Mouser; Supplier Part Number 2: 512-FDMC3612; Supplier 3: Farnell; Supplier Part Number 3: 2083247
R25 R26 R31 R102-R104 R106 R147-R151 = Resistor: as R15 on sheet Sheet2; Supplier Part No.: P51DECT-ND; Supplier: Digikey Electronics
T1 = 7490220122: 350ÂµH LAN 10/100/1000 Base-T Pulse Transformer 1CT:1CT Transmitter, 1CT:1CT Receiver Surface Mount; MF: Wurth Electronics; SnapEDA_Link: https://www.snapeda.com/parts/7490220122/Wurth%20Electronics%20Inc./view-part/1426413/?ref=snap; Availability: Unavailable; Value: *; MP: 7490220122; Package: SMD-2 Wurth Electronics; Price: None
U25 = TPS23861PW: No Description Available; Mfr_Name: Texas Instruments; Type: DEV; RefDes: RefDes; Copyright: Copyright (C) 2023 Ultra Librarian. All rights reserved.; Manufacturer_Part_Number: TPS23861PW